# Altium schematic sheet top.SchDoc
size Letter
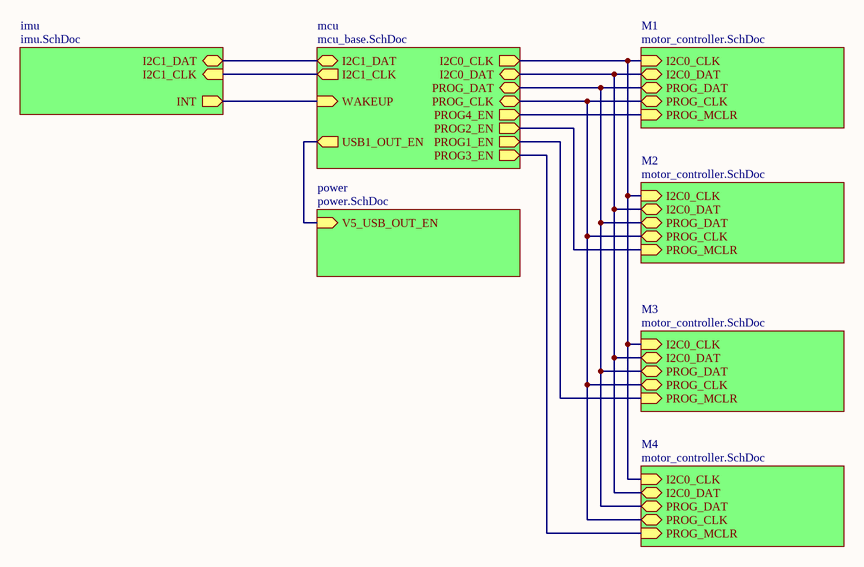
[diagram p0: top.SchDoc]

## Sub-sheets
imu = imu.SchDoc: I2C1_DAT (bidir), I2C1_CLK (in), INT (out)
M1 = motor_controller.SchDoc: I2C0_CLK (in), I2C0_DAT (bidir), PROG_DAT (bidir), PROG_CLK (bidir), PROG_MCLR (in)
M2 = motor_controller.SchDoc: I2C0_CLK (in), I2C0_DAT (bidir), PROG_DAT (bidir), PROG_CLK (bidir), PROG_MCLR (in)
M3 = motor_controller.SchDoc: I2C0_CLK (in), I2C0_DAT (bidir), PROG_DAT (bidir), PROG_CLK (bidir), PROG_MCLR (in)
M4 = motor_controller.SchDoc: I2C0_CLK (in), I2C0_DAT (bidir), PROG_DAT (bidir), PROG_CLK (bidir), PROG_MCLR (in)
mcu = mcu_base.SchDoc: I2C1_CLK (out), I2C1_DAT (bidir), I2C0_DAT (bidir), I2C0_CLK (out), USB1_OUT_EN (out), PROG1_EN (out), PROG2_EN (out), PROG3_EN (out), PROG4_EN (out), PROG_DAT (bidir), PROG_CLK (bidir), WAKEUP (in)
power = power.SchDoc: V5_USB_OUT_EN (in)

## Nets
(unnamed): sheet M1/I2C0_CLK, sheet mcu/I2C0_CLK, sheet M2/I2C0_CLK, sheet M3/I2C0_CLK, sheet M4/I2C0_CLK
(unnamed): sheet M1/I2C0_DAT, sheet mcu/I2C0_DAT, sheet M2/I2C0_DAT, sheet M3/I2C0_DAT, sheet M4/I2C0_DAT
(unnamed): sheet M1/PROG_DAT, sheet mcu/PROG_DAT, sheet M2/PROG_DAT, sheet M3/PROG_DAT, sheet M4/PROG_DAT
(unnamed): sheet M1/PROG_CLK, sheet mcu/PROG_CLK, sheet M2/PROG_CLK, sheet M3/PROG_CLK, sheet M4/PROG_CLK
(unnamed): sheet M1/PROG_MCLR, sheet mcu/PROG4_EN
(unnamed): sheet mcu/I2C1_CLK, sheet imu/I2C1_CLK
(unnamed): sheet mcu/I2C1_DAT, sheet imu/I2C1_DAT
(unnamed): sheet mcu/USB1_OUT_EN, sheet power/V5_USB_OUT_EN
(unnamed): sheet mcu/PROG1_EN, sheet M3/PROG_MCLR
(unnamed): sheet mcu/PROG2_EN, sheet M2/PROG_MCLR
(unnamed): sheet mcu/PROG3_EN, sheet M4/PROG_MCLR
(unnamed): sheet mcu/WAKEUP, sheet imu/INT